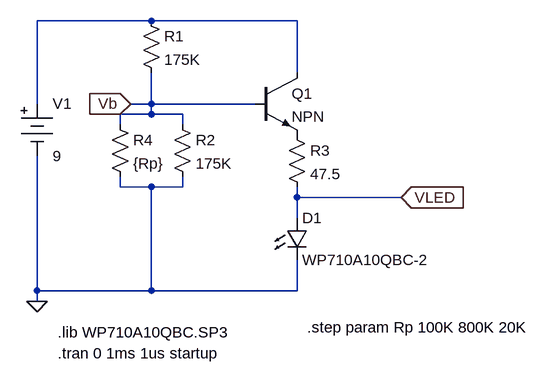
[diagram p0: schematic Thermoresistor led.asc]
Thermoresistor led.asc, the LTspice schematic file:
Version 4
SHEET 1 1052 704
WIRE 464 176 288 176
WIRE 688 176 464 176
WIRE 688 256 688 176
WIRE 288 304 288 176
WIRE 464 304 464 256
WIRE 464 304 432 304
WIRE 624 304 464 304
WIRE 464 320 464 304
WIRE 464 320 416 320
WIRE 512 320 464 320
WIRE 416 336 416 320
WIRE 512 336 512 320
WIRE 416 432 416 416
WIRE 464 432 416 432
WIRE 512 432 512 416
WIRE 512 432 464 432
WIRE 688 448 688 432
WIRE 848 448 688 448
WIRE 688 480 688 448
WIRE 288 592 288 384
WIRE 464 592 464 432
WIRE 464 592 288 592
WIRE 688 592 688 544
WIRE 688 592 464 592
WIRE 288 608 288 592
FLAG 288 608 0
FLAG 848 448 VLED
IOPIN 848 448 In
FLAG 432 304 Vb
IOPIN 432 304 In
SYMBOL Misc/battery 288 288 R0
SYMATTR InstName V1
SYMATTR Value 9
SYMBOL res 448 160 R0
SYMATTR InstName R1
SYMATTR Value 175K
SYMBOL res 496 320 R0
SYMATTR InstName R2
SYMATTR Value 175K
SYMBOL res 672 336 R0
SYMATTR InstName R3
SYMATTR Value 47.5
SYMBOL res 400 320 R0
SYMATTR InstName R4
SYMATTR Value {Rp}
SYMBOL npn 624 256 R0
SYMATTR InstName Q1
SYMBOL LED 672 480 R0
SYMATTR InstName D1
SYMATTR Value WP710A10QBC-2
TEXT 320 656 Left 2 !.lib WP710A10QBC.SP3
TEXT 320 688 Left 2 !.tran 0 1ms 1us startup
TEXT 704 648 Left 2 !.step param Rp 100K 800K 20K

The netlist it stands for:
* Thermoresistor led.asc
V1 N001 0 9
R1 N001 Vb 175K
R2 Vb 0 175K
R3 P001 VLED 47.5
R4 Vb 0 {Rp}
Q1 N001 Vb P001 0 NPN
D1 VLED 0 WP710A10QBC-2
.model D D
.lib standard.dio
.model NPN NPN
.model PNP PNP
.lib standard.bjt
.lib WP710A10QBC.SP3
.tran 0 1ms 1us startup
.step param Rp 100K 800K 20K
.backanno
.end